# EAGLE schematic Uni_Seriell (EAGLE 9.6.2)
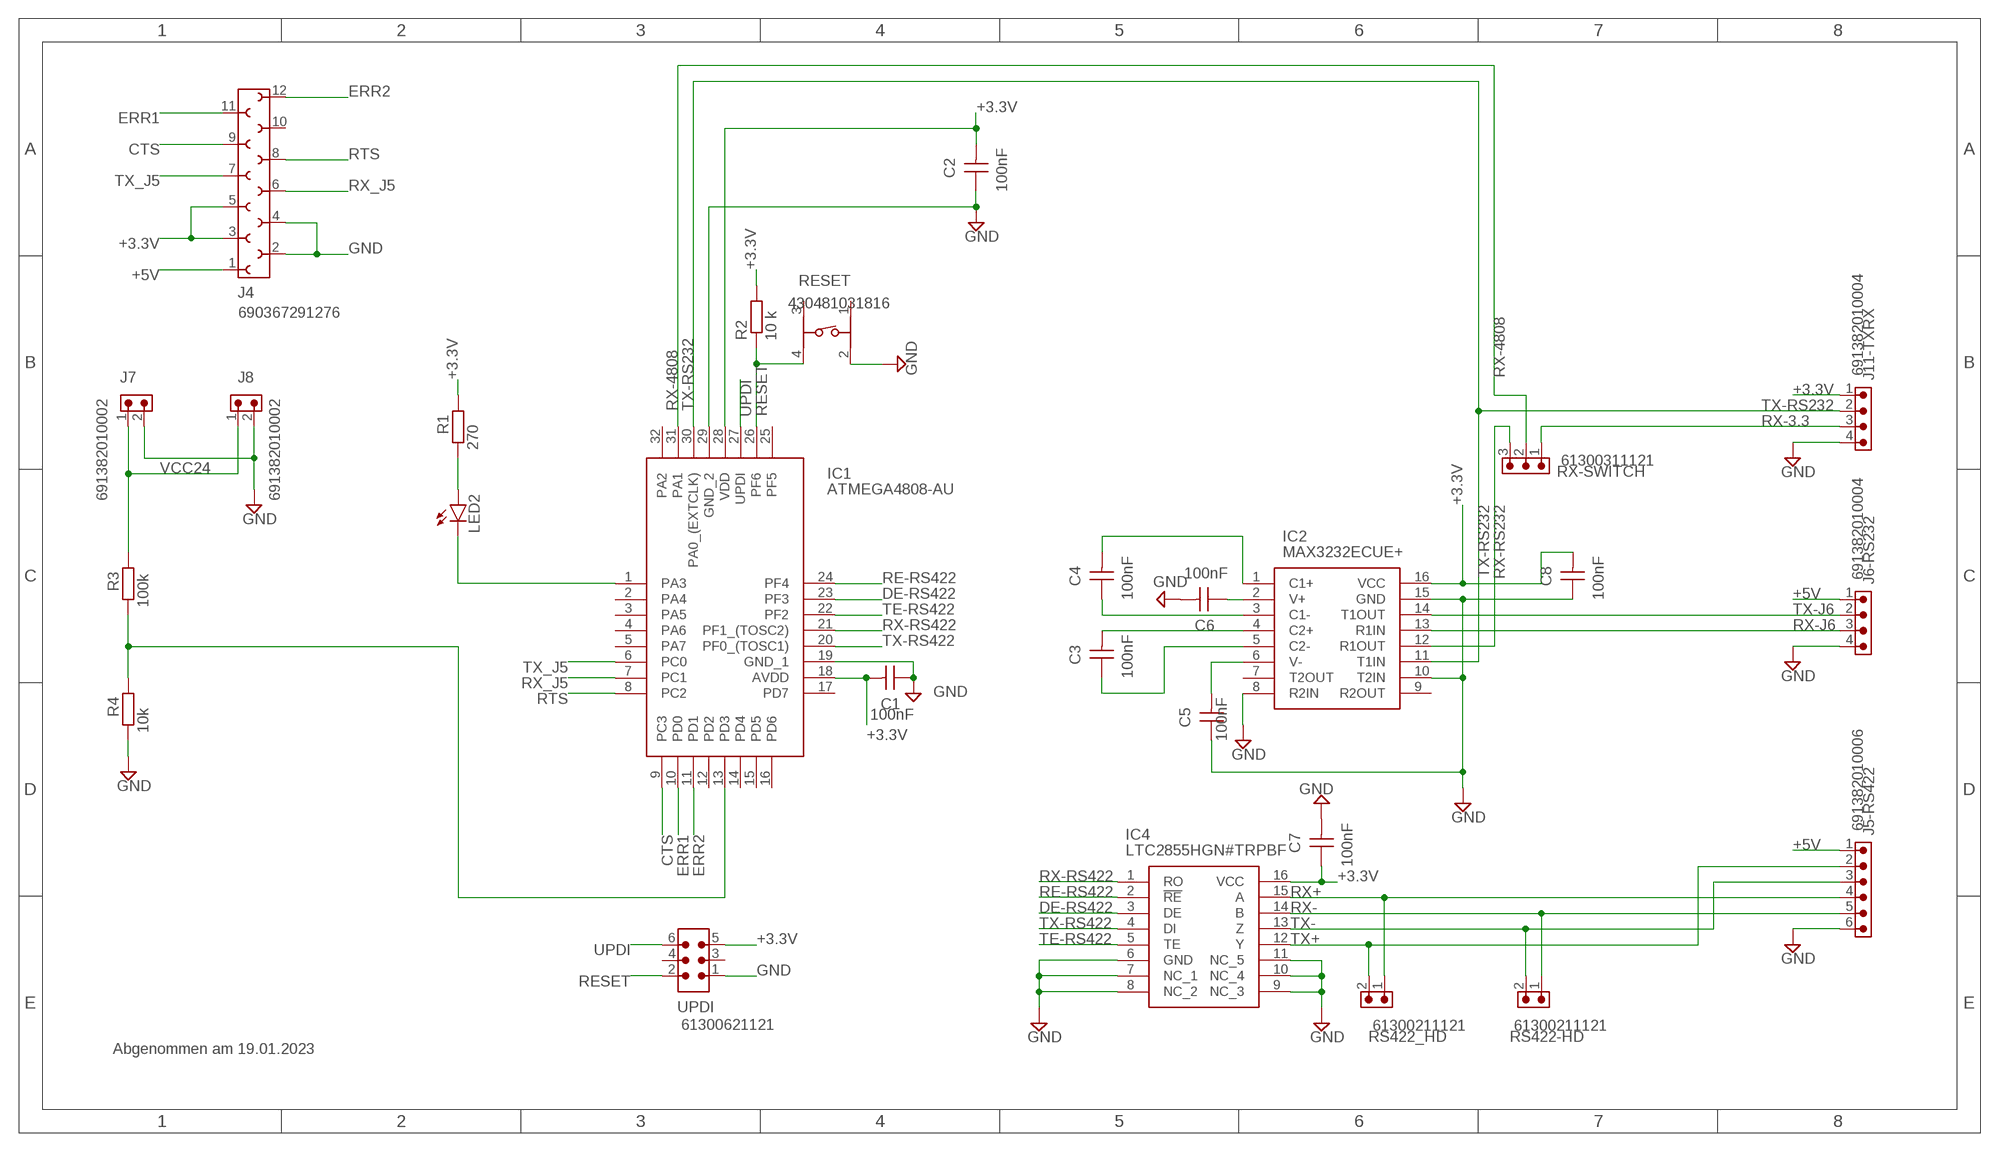
[diagram p0: schematic, sheet 1]

## Parts
C1  100nF  WCAP-CSST_0805_885382207007  [WCAP-CSST_0805]
C2  100nF  WCAP-CSST_0805_885382207007  [WCAP-CSST_0805]
C3  100nF  WCAP-CSST_0805_885382207007  [WCAP-CSST_0805]
C4  100nF  WCAP-CSST_0805_885382207007  [WCAP-CSST_0805]
C5  100nF  WCAP-CSST_0805_885382207007  [WCAP-CSST_0805]
C6  100nF  WCAP-CSST_0805_885382207007  [WCAP-CSST_0805]
C7  100nF  WCAP-CSST_0805_885382207007  [WCAP-CSST_0805]
C8  100nF  WCAP-CSST_0805_885382207007  [WCAP-CSST_0805]
IC1  ATMEGA4808-AU  [QFP80P900X900X120-32N]
IC2  MAX3232ECUE+  [SOP65P640X110-16N]
IC4  LTC2855HGN#TRPBF  [SOP64P601X175-16N]
J4  690367291276  [690367291276]
J5-RS422  691382010006  691382010006  [691382010006]
J6-RS232  691382010004  691382010004  [691382010004]
J7  691382010002  691382010002  [691382010002]
J8  691382010002  691382010002  [691382010002]
J11-TXRX  691382010004  691382010004  [691382010004]
LED2  LEDCHIP-LED0805  [CHIP-LED0805]
R1  270  R-EU_R0805  [R0805]
R2  10 k  R-EU_R0805  [R0805]
R3  100k  R-EU_R0805  [R0805]
R4  10k  R-EU_R0805  [R0805]
RESET  430481031816  [430481031816]
RS422-HD  61300211121  6130XX11121_61300211121  [61300211121]
RS422_HD  61300211121  6130XX11121_61300211121  [61300211121]
RX-SWITCH  61300311121  6130XX11121_61300311121  [61300311121]
UPDI  61300621121  6130XX21121_61300621121  [61300621121]

## Nets
+3.3V: C1.2 C2.2 C7.1 C8.2 IC1.18(AVDD) IC1.28(VDD) IC2.16(VCC) IC4.16(VCC) J4.3 J4.5 J11-TXRX.1 R1.2 R2.2 UPDI.5
+5V: J4.1 J5-RS422.1 J6-RS232.1
CTS: IC1.9(PC3) J4.9
DE-RS422: IC1.23(PF3) IC4.3(DE)
ERR1: IC1.10(PD0) J4.11
ERR2: IC1.11(PD1) J4.12
GND: C1.1 C2.1 C5.1 C6.2 C7.2 C8.1 IC1.19(GND_1) IC1.29(GND_2) IC2.8(R2IN) IC2.10(T2IN) IC2.15(GND) IC4.6(GND) IC4.7(NC_1) IC4.8(NC_2) IC4.9(NC_3) IC4.10(NC_4) IC4.11(NC_5) J4.2 J4.4 J5-RS422.6 J6-RS232.4 J7.2 J8.2 J11-TXRX.4 R4.1 RESET.2 UPDI.1
N$2: IC1.13(PD3) R3.1 R4.2
N$3: IC1.1(PA3) LED2.C
N$7: LED2.A R1.1
N$9: C5.2 IC2.6(V-)
N$10: C6.1 IC2.2(V+)
N$11: C3.2 IC2.4(C2+)
N$12: C3.1 IC2.5(C2-)
N$13: C4.1 IC2.3(C1-)
N$14: C4.2 IC2.1(C1+)
RE-RS422: IC1.24(PF4) IC4.2(!RE)
RESET: IC1.26(PF6) R2.1 RESET.4 UPDI.2
RTS: IC1.8(PC2) J4.8
RX+: IC4.15(A) J5-RS422.4 RS422_HD.1
RX-: IC4.14(B) J5-RS422.5 RS422-HD.1
RX-3.3: J11-TXRX.3 RX-SWITCH.1
RX-4808: IC1.31(PA1) RX-SWITCH.2
RX-J6: IC2.13(R1IN) J6-RS232.3
RX-RS232: IC2.12(R1OUT) RX-SWITCH.3
RX-RS422: IC1.21(PF1_(TOSC2)) IC4.1(RO)
RX_J5: IC1.7(PC1) J4.6
TE-RS422: IC1.22(PF2) IC4.5(TE)
TX+: IC4.12(Y) J5-RS422.2 RS422_HD.2
TX-: IC4.13(Z) J5-RS422.3 RS422-HD.2
TX-J6: IC2.14(T1OUT) J6-RS232.2
TX-RS232: IC1.30(PA0_(EXTCLK)) IC2.11(T1IN) J11-TXRX.2
TX-RS422: IC1.20(PF0_(TOSC1)) IC4.4(DI)
TX_J5: IC1.6(PC0) J4.7
UPDI: IC1.27(UPDI) UPDI.6
VCC24: J7.1 J8.1 R3.2
Unconnected: IC1.2(PA4) IC1.3(PA5) IC1.4(PA6) IC1.5(PA7) IC1.12(PD2) IC1.14(PD4) IC1.15(PD5) IC1.16(PD6) IC1.17(PD7) IC1.25(PF5) IC1.32(PA2) IC2.7(T2OUT) IC2.9(R2OUT) J4.10 RESET.1 RESET.3 UPDI.3 UPDI.4

## Notes on the sheet
- Abgenommen am 19.01.2023

## Library data of the parts
C1-C8 = Eagle_WCAP-CSST (rev20a):WCAP-CSST_0805: WCAP-CSST MLCCs Soft Termination Characteristics Product series with high absorbtion of mechanical stress Mounting style: SMT-Chip Capacitance range: 220 pF - 2.2 µF Temperature Coefficient: ± 15 % Voltage range (UR): 16 V(DC) - 2 kV(DC) Operating temperature: -55 °C up to + 125 °C Sizes: 0603 / 0805 / 1206 / 1210 Termination: Ag-Polymer/Ni/Sn Recommended soldering: Reflow soldering Wave soldering (only valid for the thickness ≤0.85 mm) Applications Application with high mechanical stress Power supply Lighting <https://www.we-online.com/catalog/media/o164343v209%20Family_WE-MLCC_1210_dunkelbraun.jpg> Details see: https://www.we-online.com/catalog/en/WCAP-CSST/ Updated by yingchun,Shan;2020-03-10 2020(C) Würth Elektronik; CERAMIC-TYPE: X7R Class II; DATASHEET-URL: https://www.we-online.com/catalog/datasheet/885382207007.pdf; DF: 2.50%; H: 1.25mm; OPERATING-TEMPERATURE: -55 / +125°C; PART-NUMBER: 885382207007; RISO: 5GOhm; TECHNICAL-REFERENCE: X7R0805104K050DFCT1S000; TOL-C: +/- 10%; VR: 50V(DC)
IC1 = ATMEGA4808-AU:ATMEGA4808-AU: 8-bit Microcontrollers - MCU 20MHz, 48KB, TQFP Source: Datasheet <https://eu.mouser.com/datasheet/2/268/ATmega4808_09_DataSheet_DS40002173B-1863819.pdf>; DESCRIPTION: 8-bit Microcontrollers - MCU 20MHz, 48KB, TQFP; HEIGHT: 1.2mm; MANUFACTURER_NAME: Microchip; MANUFACTURER_PART_NUMBER: ATMEGA4808-AU; MOUSER_PART_NUMBER: 556-ATMEGA4808-AU; MOUSER_PRICE-STOCK: https://www.mouser.co.uk/ProductDetail/Microchip-Technology-Atmel/ATMEGA4808-AU?qs=P1JMDcb91o4OSr3c6aXxLg%3D%3D
IC2 = MAX3232ECUE+:MAX3232ECUE+: MAX3232ECUE+, Line Transceiver, EIA/TIA-232, RS-232, V.24, V.28 2 2 2 250 kbit/s, 3 5.5 V, 16-Pin TSSOP Source: Datasheet <http://datasheets.maximintegrated.com/en/ds/MAX3222E-MAX3246E.pdf>; ARROW_PART_NUMBER: MAX3232ECUE+; ARROW_PRICE-STOCK: https://www.arrow.com/en/products/max3232ecue/maxim-integrated?region=nac; DESCRIPTION: MAX3232ECUE+, Line Transceiver, EIA/TIA-232, RS-232, V.24, V.28 2 2 2 250 kbit/s, 3 5.5 V, 16-Pin TSSOP; HEIGHT: 1.1mm; MANUFACTURER_NAME: Maxim Integrated; MANUFACTURER_PART_NUMBER: MAX3232ECUE+; MOUSER_PART_NUMBER: 700-MAX3232ECUE; MOUSER_PRICE-STOCK: https://www.mouser.co.uk/ProductDetail/Maxim-Integrated/MAX3232ECUE%2b?qs=CDqwynd4ZNpmT%2FV4ySc5XQ%3D%3D
IC4 = LTC2855HGN#TRPBF:LTC2855HGN#TRPBF: Single Transmitter/Receiver RS-422/RS-485 Automotive 16-Pin SSOP N T/R Source: Datasheet <https://www.analog.com/media/en/technical-documentation/data-sheets/285455fc.pdf>; ARROW_PART_NUMBER: LTC2855HGN#TRPBF; ARROW_PRICE-STOCK: https://www.arrow.com/en/products/ltc2855hgntrpbf/analog-devices?region=nac; DESCRIPTION: Single Transmitter/Receiver RS-422/RS-485 Automotive 16-Pin SSOP N T/R; HEIGHT: 1.75mm; MANUFACTURER_NAME: Analog Devices; MANUFACTURER_PART_NUMBER: LTC2855HGN#TRPBF; MOUSER_PART_NUMBER: 584-LTC2855HGN#TRPBF; MOUSER_PRICE-STOCK: https://www.mouser.co.uk/ProductDetail/Analog-Devices/LTC2855HGNTRPBF?qs=hVkxg5c3xu8VZzRcM9aCcw%3D%3D
J4 = Wurth_Connectors_WR-MM:690367291276: WR-MM Female SMT Connector with Latch & Polarization KIND PROPERTIES: Pitch 2.54 mm Gender:Female MATERIAL PROPERTIES: Insulator Material:PA6T Insulator Flammability Rating UL94 V-0 Insulator Color:Red Contact Material :Phosphor Bronze Contact Plating :Mat Tin over Nickel Contact Type: Stamped GENERAL PROPERTIES: Operating Temperature:-40 °C up to +105 °C Compliance Lead free / RoHS ELECTRICAL PROPERTIES: Working Voltage 100 V (AC) Withstanding Voltage:500 V (AC) Contact Resistance: 10 mΩ Insulation Resistance:1000 MΩ PACKAGING PROPERTIES: cULus Approval:E323964 Packaging :Tape and Reel <https://katalog.we-online.com/media/images/v2/o33161v209%20WR-MiMo_69036729xx76.jpg> Details see: Web 1: https://katalog.we-online.com/en/em/MM_1_27_SMT_FEMALE_CONNECTOR_WITH_LATCH_AND_POLARIZATION_69036729XX76_2 Web2: https://katalog.we-online.com/en/em/MM_1_27_SMT_FEMALE_CONNECTOR_WITH_LATCH_AND_POLARIZATION_69036729XX76 Updated by Yingchun,Shan 2019-10-28 2019 (C) Würth Elektronik; DATASHEET-URL: https://www.we-online.com/catalog/datasheet/690367291276.pdf; GENDER: Female; IR: 1.5A; PACKAGING: Tape and Reel; PART-NUMBER: 690367291276; PINS: 12; PITCH: 2.54; TYPE: Straight
J5-RS422 = Wurth_Connectors_WR-TBL Pluggable Connector:691382010006: WR-TBL Serie 382 - 2.50 mm Horizontal PCB Header KIND PROPERTIES Pitch 2.5 mm MATERIAL PROPERTIES Insulator Material PA66 Insulator Flammability Rating UL94 V-0 Contact Material Copper Alloy Contact Plating Tin Contact Type Stamped GENERAL INFORMATION Operating Temperature -40 up to +105 °C Compliance RoHS ELECTRICAL PROPERTIES IR cULus 12 A Working Voltage [cULus] 300 V (AC) Withstanding Voltage [cULus] 1000 V (AC) Contact Resistance [cULus] 20 mΩ CERTIFICATION cULus Approval E315414 <https://www.we-online.com/catalog/media/o55402v209%20Family_WR-TBL_Serie_382_6913820100xx.jpg> Details see: https://www.we-online.com/catalog/en/TBL_2_50_382_HORIZONTAL_PCB_HEADER_69138201000X/ Updated by Ella Wu 2019-12-13 2019(C) Wurth Elektronik; DATASHEET-URL: https://www.we-online.com/catalog/datasheet/691382010006.pdf; IR-UL: 12A; MOUNT: THT; PART-NUMBER: 691382010006; PINS: 6; PITCH: 2.5mm; TYPE: Horizontal; WORKING-VOLTAGE-UL: 300V (AC)
J6-RS232 J11-TXRX = Wurth_Connectors_WR-TBL Pluggable Connector:691382010004: WR-TBL Serie 382 - 2.50 mm Horizontal PCB Header KIND PROPERTIES Pitch 2.5 mm MATERIAL PROPERTIES Insulator Material PA66 Insulator Flammability Rating UL94 V-0 Contact Material Copper Alloy Contact Plating Tin Contact Type Stamped GENERAL INFORMATION Operating Temperature -40 up to +105 °C Compliance RoHS ELECTRICAL PROPERTIES IR cULus 12 A Working Voltage [cULus] 300 V (AC) Withstanding Voltage [cULus] 1000 V (AC) Contact Resistance [cULus] 20 mΩ CERTIFICATION cULus Approval E315414 <https://www.we-online.com/catalog/media/o55402v209%20Family_WR-TBL_Serie_382_6913820100xx.jpg> Details see: https://www.we-online.com/catalog/en/TBL_2_50_382_HORIZONTAL_PCB_HEADER_69138201000X/ Updated by Ella Wu 2019-12-13 2019(C) Wurth Elektronik; DATASHEET-URL: https://www.we-online.com/catalog/datasheet/691382010004.pdf; IR-UL: 12A; MOUNT: THT; PART-NUMBER: 691382010004; PINS: 4; PITCH: 2.5mm; TYPE: Horizontal; WORKING-VOLTAGE-UL: 300V (AC)
J7 J8 = Wurth_Connectors_WR-TBL Pluggable Connector:691382010002: WR-TBL Serie 382 - 2.50 mm Horizontal PCB Header KIND PROPERTIES Pitch 2.5 mm MATERIAL PROPERTIES Insulator Material PA66 Insulator Flammability Rating UL94 V-0 Contact Material Copper Alloy Contact Plating Tin Contact Type Stamped GENERAL INFORMATION Operating Temperature -40 up to +105 °C Compliance RoHS ELECTRICAL PROPERTIES IR cULus 12 A Working Voltage [cULus] 300 V (AC) Withstanding Voltage [cULus] 1000 V (AC) Contact Resistance [cULus] 20 mΩ CERTIFICATION cULus Approval E315414 <https://www.we-online.com/catalog/media/o55402v209%20Family_WR-TBL_Serie_382_6913820100xx.jpg> Details see: https://www.we-online.com/catalog/en/TBL_2_50_382_HORIZONTAL_PCB_HEADER_69138201000X/ Updated by Ella Wu 2019-12-13 2019(C) Wurth Elektronik; DATASHEET-URL: https://www.we-online.com/catalog/datasheet/691382010002.pdf; IR-UL: 12A; MOUNT: THT; PART-NUMBER: 691382010002; PINS: 2; PITCH: 2.5mm; TYPE: Horizontal; WORKING-VOLTAGE-UL: 300V (AC)
LED2 = led:LED: LED OSRAM: - CHIPLED LG R971, LG N971, LY N971, LG Q971, LY Q971, LO R971, LY R971 LH N974, LH R974 LS Q976, LO Q976, LY Q976 LO Q996 - Hyper CHIPLED LW Q18S LB Q993, LB Q99A, LB R99A - SideLED LS A670, LO A670, LY A670, LG A670, LP A670 LB A673, LV A673, LT A673, LW A673 LH A674 LY A675 LS A676, LA A676, LO A676, LY A676, LW A676 LS A679, LY A679, LG A679 - Hyper Micro SIDELED® LS Y876, LA Y876, LO Y876, LY Y876 LT Y87S - SmartLED LW L88C, LW L88S LB L89C, LB L89S, LG L890 LS L89K, LO L89K, LY L89K LS L896, LA L896, LO L896, LY L896 - TOPLED LS T670, LO T670, LY T670, LG T670, LP T670 LSG T670, LSP T670, LSY T670, LOP T670, LYG T670 LG T671, LOG T671, LSG T671 LB T673, LV T673, LT T673, LW T673 LH T674 LS T676, LA T676, LO T676, LY T676, LB T676, LH T676, LSB T676, LW T676 LB T67C, LV T67C, LT T67C, LS T67K, LO T67K, LY T67K, LW E67C LS E67B, LA E67B, LO E67B, LY E67B, LB E67C, LV E67C, LT E67C LW T67C LS T679, LY T679, LG T679 LS T770, LO T770, LY T770, LG T770, LP T770 LB T773, LV T773, LT T773, LW T773 LH T774 LS E675, LA E675, LY E675, LS T675 LS T776, LA T776, LO T776, LY T776, LB T776 LHGB T686 LT T68C, LB T68C - Hyper Mini TOPLED® LB M676 - Mini TOPLED Santana® LG M470 LS M47K, LO M47K, LY M47K Source: http://www.osram.convergy.de LUXEON: - LUMILED® LXK2-PW12-R00, LXK2-PW12-S00, LXK2-PW14-U00, LXK2-PW14-V00 LXK2-PM12-R00, LXK2-PM12-S00, LXK2-PM14-U00 LXK2-PE12-Q00, LXK2-PE12-R00, LXK2-PE12-S00, LXK2-PE14-T00, LXK2-PE14-U00 LXK2-PB12-K00, LXK2-PB12-L00, LXK2-PB12-M00, LXK2-PB14-N00, LXK2-PB14-P00, LXK2-PB14-Q00 LXK2-PR12-L00, LXK2-PR12-M00, LXK2-PR14-Q00, LXK2-PR14-R00 LXK2-PD12-Q00, LXK2-PD12-R00, LXK2-PD12-S00 LXK2-PH12-R00, LXK2-PH12-S00 LXK2-PL12-P00, LXK2-PL12-Q00, LXK2-PL12-R00 Source: www.luxeon.com KINGBRIGHT: KA-3528ASYC Source: www.kingbright.com
R1-R4 = rcl:R-EU_: RESISTOR, European symbol; SPICEPREFIX: R
RESET = Eagle_WS-TASV (rev22b):430481031816: WS-TASV SMT Washable Tact Switch 6x6 mm Material Properties Cover Material : Stainless Steel Properties Actuator Material:LCP Actuator Flammability :UL94 V-0 Rating Actuator Color:Black; Salmon; White Contact Material:Stainless Steel Contact Plating:Silver Terminal Plating:Silver VR:12 V (DC) RISO:100 MΩ Withstanding Voltage:250 V (AC) Washable:Yes Qty.:2000 Mechanical Properties Stroke :0.25 mm General Information Operating Temperature:-40 up to +85 °C Washable:Yes Packaging Properties Packaging:Tape and Reel <https://www.we-online.com/catalog/media/o37542v209%20Family_WS-TASV_SMD_Tact_Switch_6x6mm_4304810xx8xx.jpg> Details see: https://www.we-online.com/catalog/en/TASV_6X6_SMD_WASHABLE/ Updated by Ella Wu 2021-02-23 2021(C) Würth Elektronik; DATASHEET-URL: https://www.we-online.com/redexpert/spec/430481031816?ae; H: 3.1mm; OPERATION-FORCE: 160g; PART-NUMBER: 430481031816; QTY: 2000
RS422-HD RS422_HD = Eagle_WR-PHD (rev22a):6130XX11121_61300211121: WR-PHD 2.54 mm THT Pin Header ARTICLE PROPERTIES: Pins:1;​ 2;​ 3;​ 4;​ 5;​ 6;​ 7;​ 8;​ 9;​ 10;​ 12;​ 13;​ 14;​ 15;​ 16;​ 18;​ 20;​ 22;​ 24;​ 25;​ 32;​ 36;​ 40 KIND PROPERTIES: Pitch：2.54 mm Quality Class:3 as per CECC 75 301-802 Rows：Single Gender：Pin Header Type：Straight MATERIAL PROPERTIES: Insulator Material PA6T; PBT Insulator Flammability Rating:UL94 V-0 Contact Material:Copper Alloy Contact Plating:Gold Contact Type:Stamped GENERAL INFORMATION Operating Temperature:-40 up to +105 °C ELECTRICAL PROPERTIES: Withstanding Voltage 500 V (AC) Contact Resistance 20 mΩ RISO 1000 MΩ CERTIFICATION UL Approval:E323964 PACKAGING PROPERTIES Packaging:Bag <https://www.we-online.com/catalog/media/o33211v209%20Family_BTB_PHD_6130xx11121.jpg> Details see: https://www.we-online.com/katalog/en/em/PHD_2_54_THT_PIN_HEADER_6130XX11121 Updated by Ella Wu 2021-12-08 2021 (C) Würth Elektronik; DATASHEET-URL: https://www.we-online.com/redexpert/spec/61300211121?ae; GENDER: Pin Header; IR: 3A; MOUNT: THT; PACKAGING: Bag; PART-NUMBER: 61300211121; PINS: 2; PITCH: 2.54mm; ROWS: Single; TYPE: Straight
RX-SWITCH = Wurth_Connectors_WR-PHD:6130XX11121_61300311121: WR-PHD 2.54 mm THT Pin Header ARTICLE PROPERTIES: Pins:1;​ 2;​ 3;​ 4;​ 5;​ 6;​ 7;​ 8;​ 9;​ 10;​ 12;​ 13;​ 14;​ 15;​ 16;​ 18;​ 20;​ 22;​ 24;​ 25;​ 32;​ 36;​ 40 KIND PROPERTIES: Pitch：2.54 mm Quality Class:3 as per CECC 75 301-802 Rows：Single Gender：Pin Header Type：Straight MATERIAL PROPERTIES: Insulator Material PA6T; PBT Insulator Flammability Rating:UL94 V-0 Contact Material:Copper Alloy Contact Plating:Gold Contact Type:Stamped GENERAL INFORMATION Operating Temperature:-40 up to +105 °C ELECTRICAL PROPERTIES: Withstanding Voltage 500 V (AC) Contact Resistance 20 mΩ RISO 1000 MΩ CERTIFICATION UL Approval:E323964 PACKAGING PROPERTIES Packaging:Bag <https://www.we-online.com/catalog/media/o33211v209%20Family_BTB_PHD_6130xx11121.jpg> Details see: https://www.we-online.com/katalog/en/em/PHD_2_54_THT_PIN_HEADER_6130XX11121 Updated by Ella Wu 2021-12-08 2021 (C) Würth Elektronik; DATASHEET-URL: https://www.we-online.com/redexpert/spec/61300311121?ae; GENDER: Pin Header; IR: 3A; MOUNT: THT; PACKAGING: Bag; PART-NUMBER: 61300311121; PINS: 3; PITCH: 2.54mm; ROWS: Single; TYPE: Straight
UPDI = Wurth_Connectors_WR-PHD:6130XX21121_61300621121: WR-PHD 2.54 mm THT Dual Pin Header ARTICLE PROPERTIES: Pins:4;​ 6;​ 8;​ 10;​ 12;​ 14;​ 16;​ 18;​ 20;​ 22;​ 24;​ 26;​ 28;​ 30;​ 32;​ 34;​ 36;​ 40;​ 44;​ 64;​ 72;​ 80 KIND PROPERTIES: Pitch：2.54 mm Quality Class:3 as per CECC 75 301-802 Rows：Dual Gender：Pin Header Type：Board Stacker MATERIAL PROPERTIES: Insulator Material :PA6T Insulator Flammability Rating:UL94 V-0 Contact Material:Copper Alloy Contact Plating:Gold Contact Type:Stamped GENERAL INFORMATION Operating Temperature:-40 up to +105 °C Compliance:Lead free / RoHS ELECTRICAL PROPERTIES: Rated Current:3 A IR 1:3 A Withstanding Voltage:500 V (AC) Contact Resistance:20 mΩ RISO:1000 MΩ CERTIFICATION UL Approval:E323964 PACKAGING PROPERTIES Packaging:Bag <https://katalog.we-online.com/media/images/v2/o33215v209%20Family_WR-PHD_6130xx21121.jpg> Details see: https://katalog.we-online.com/en/em/PHD_2_54_THT_DUAL_PIN_HEADER_6130XX21121 Updated by Yingchun,Shan 2019-10-16 2019 (C) Würth Elektronik; DATASHEET-URL: https://www.we-online.com/redexpert/spec/61300621121?ae; GENDER: Pin Header; IR: 3A; MOUNT: THT; PACKAGING: Bag; PART-NUMBER: 61300621121; PINS: 6; PITCH: 2.54mm; ROWS: Dual; TYPE: Board Stacker